# EasyEDA Pro project 显示30000版电池内阻仪.eprj, schematic Schematic1
Create Date: 2023-03-01; Page Name: P1; Project Name: 显示30000版电池内阻仪; Schematic Name: Schematic1; Update Date: 2023-04-18; Company: 嘉立创EDA; Page Size: A4; Version: V1.0
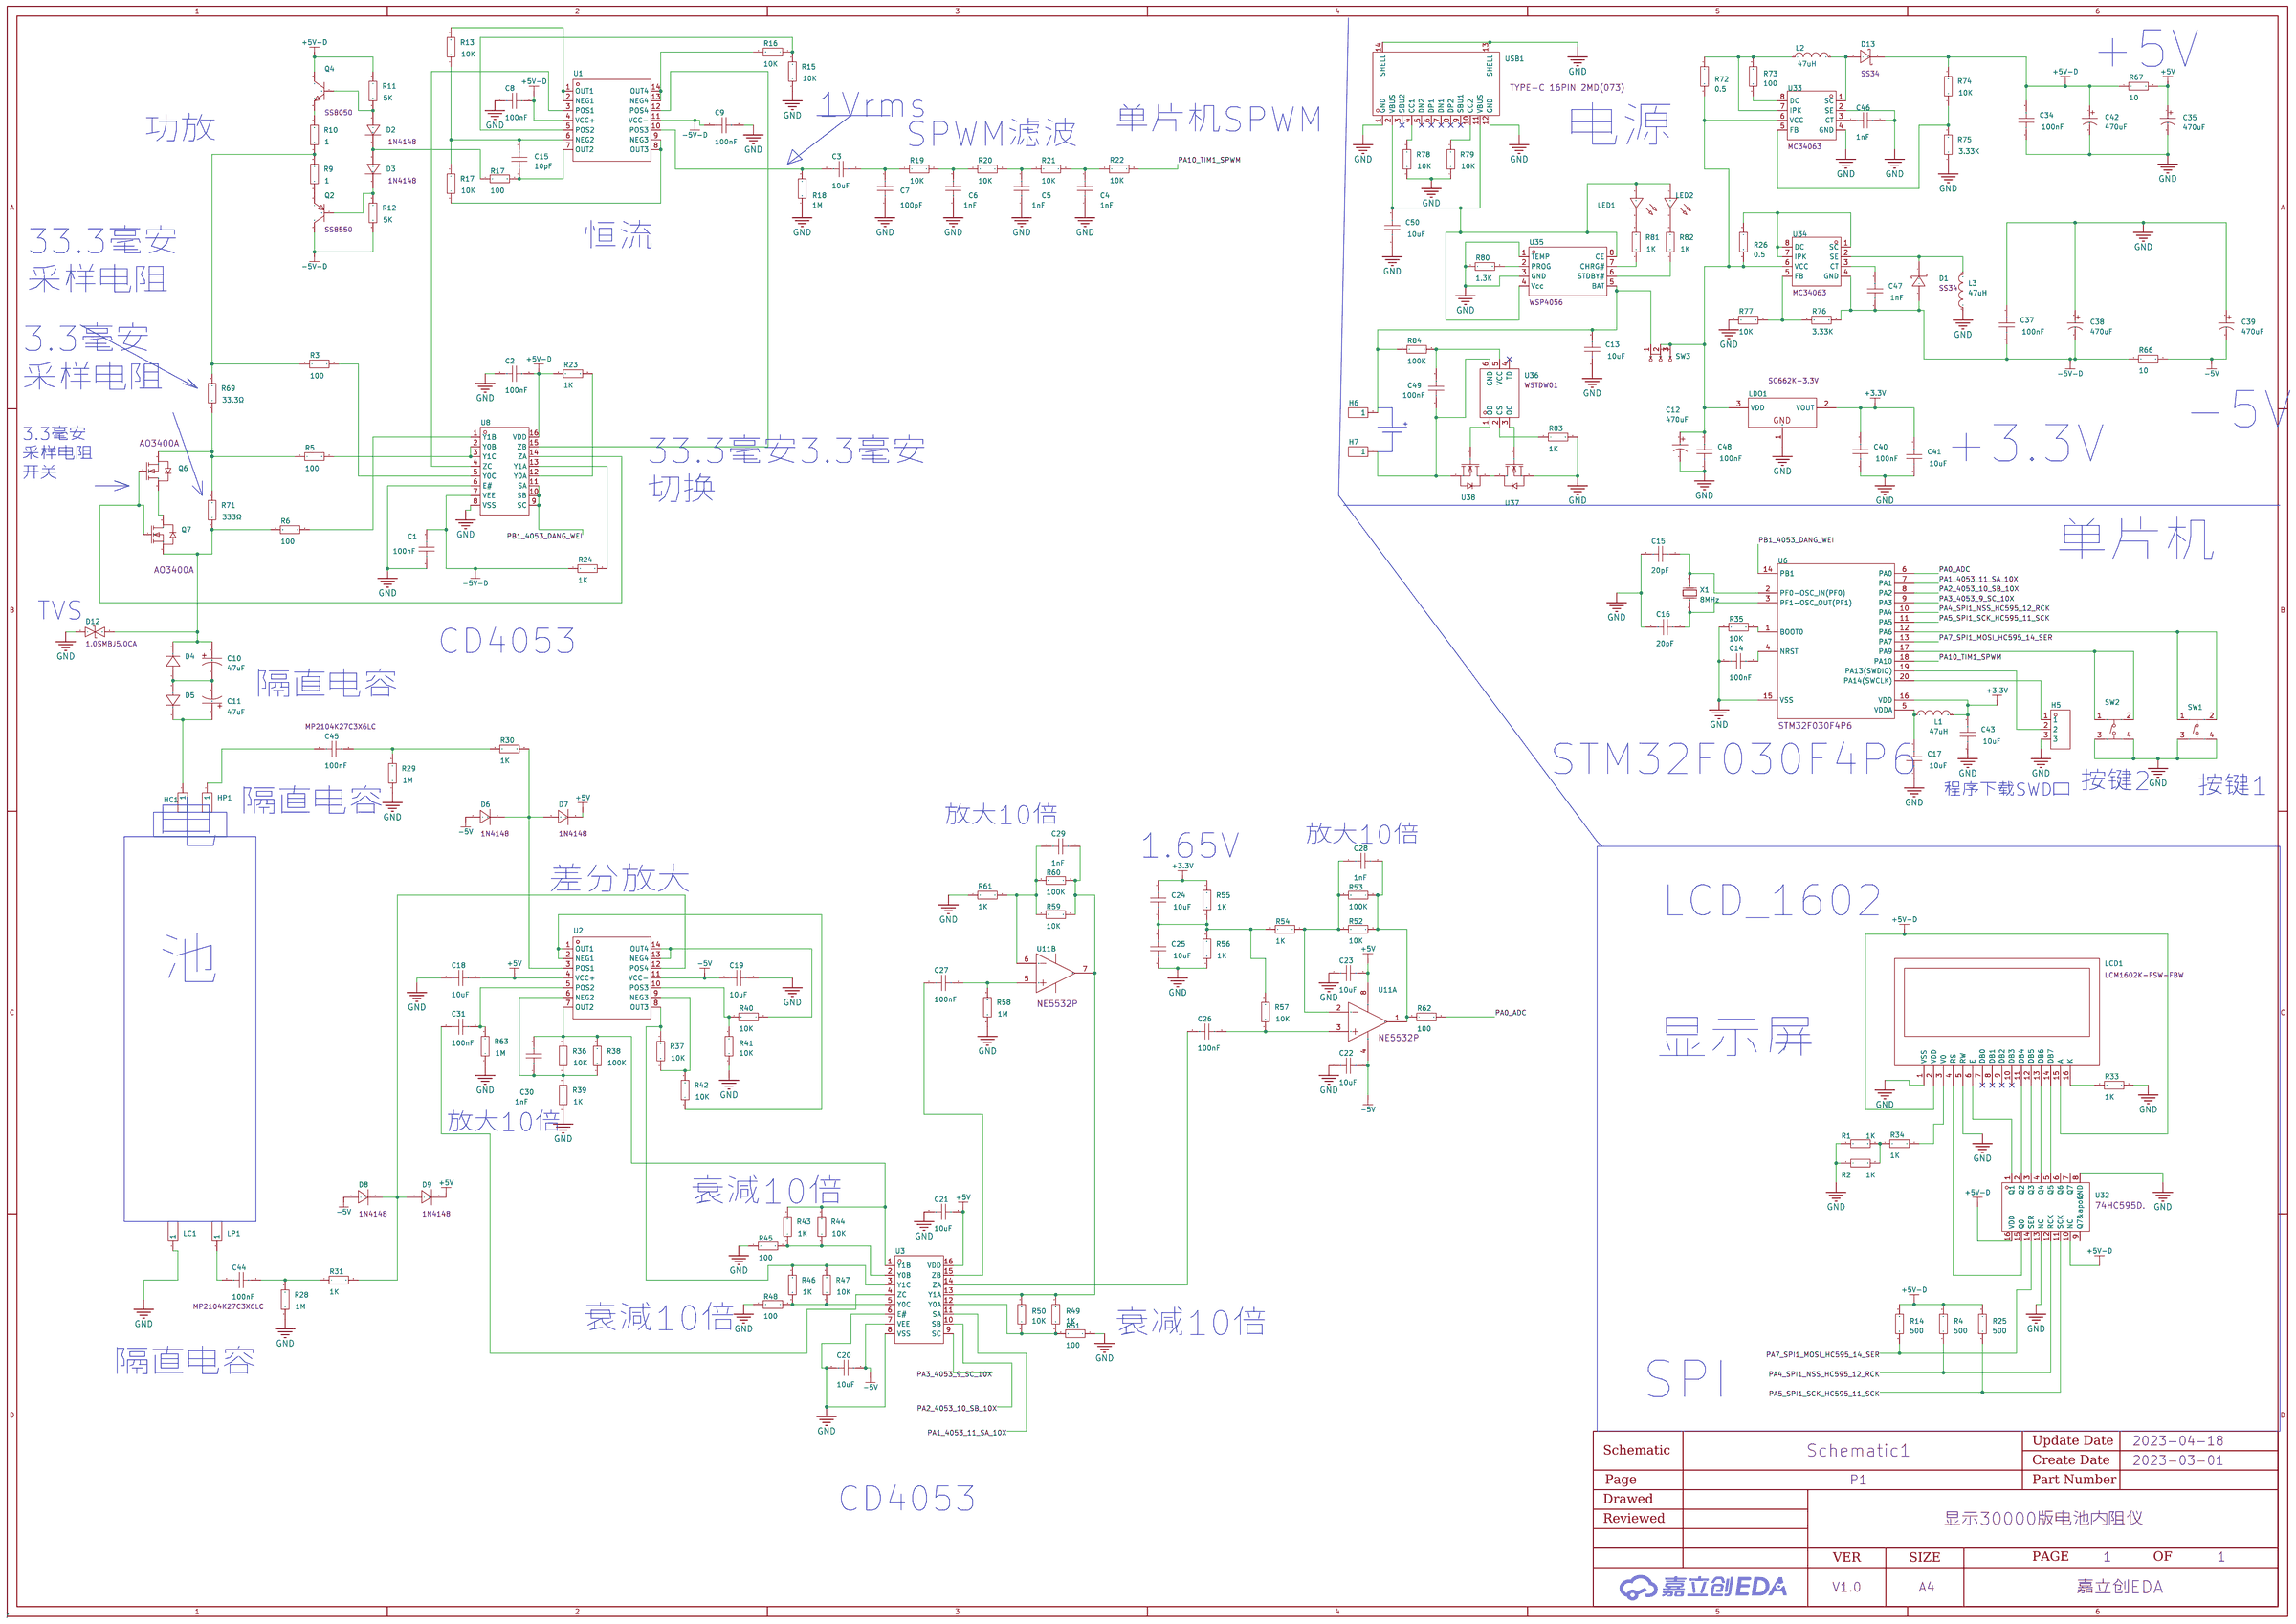
[diagram p0: schematic sheet]

## Parts
C1  100nF  [C0603]
C2  100nF  [C0603]
C3  10uF  [C0603]
C4  1nF  [C0603]
C5  1nF  [C0603]
C6  1nF  [C0603]
C7  100pF  [C0603]
C8  100nF  [C0603]
C9  100nF  [C0603]
C10  47uF  [CAP-TH_BD10.0-P5.00-D1.0-FD]
C11  47uF  [CAP-TH_BD10.0-P5.00-D1.0-FD]
C12  470uF  [CAP-TH_BD8.0-P3.50-D0.6-FD]
C13  10uF  [C0603]
C14  100nF  [C0603]
C15  20pF  [C0603]
C15#2  10pF  [C0603]
C16  20pF  [C0603]
C17  10uF  [C0603]
C18  10uF  [C0603]
C19  10uF  [C0603]
C20  10uF  [C0603]
C21  10uF  [C0603]
C22  10uF  [C0603]
C23  10uF  [C0603]
C24  10uF  [C0603]
C25  10uF  [C0603]
C26  100nF  [C0603]
C27  100nF  [C0603]
C28  1nF  [C0603]
C29  1nF  [C0603]
C30  1nF  [C0603]
C31  100nF  [C0603]
C34  100nF  [C0603]
C35  470uF  [CAP-TH_BD8.0-P3.50-D0.6-FD]
C37  100nF  [C0603]
C38  470uF  [CAP-TH_BD8.0-P3.50-D0.6-FD]
C39  470uF  [CAP-TH_BD8.0-P3.50-D0.6-FD]
C40  100nF  [C0603]
C41  10uF  [C0603]
C42  470uF  [CAP-TH_BD8.0-P3.50-D0.6-FD]
C43  10uF  [C0603]
C44  100nF  [CAP-TH_L13.0-W6.0-P10.00-D1.0]
C45  100nF  [CAP-TH_L13.0-W6.0-P10.00-D1.0]
C46  1nF  [C0603]
C47  1nF  [C0603]
C48  100nF  [C0603]
C49  100nF  [C0603]
C50  10uF  [C0603]
D1  SS34  [SMA_L4.3-W2.6-LS5.2-RD]
D2  1N4148  [DO-35_BD2.0-L4.0-P8.00-D0.5-FD]
D3  1N4148  [DO-35_BD2.0-L4.0-P8.00-D0.5-FD]
D4  -  [DO_1N4007]
D5  -  [DO_1N4007]
D6  1N4148  [DO-35_BD2.0-L4.0-P8.00-D0.5-FD]
D7  1N4148  [DO-35_BD2.0-L4.0-P8.00-D0.5-FD]
D8  1N4148  [DO-35_BD2.0-L4.0-P8.00-D0.5-FD]
D9  1N4148  [DO-35_BD2.0-L4.0-P8.00-D0.5-FD]
D12  1.0SMBJ5.0CA  [SMB_L4.6-W3.6-LS5.3-BI]
D13  SS34  [SMA_L4.3-W2.6-LS5.2-RD]
H5  -  [HDR-TH_3P-P2.54-V-M]
H6  -  [HDR-TH_1P-V-M_XKB_X4611WV-01I-C28D40]
H7  -  [HDR-TH_1P-V-M_XKB_X4611WV-01I-C28D40]
HC1  -  [HDR-TH_1P-V-M_XKB_X4611WV-01I-C28D40]
HP1  -  [HDR-TH_1P-V-M_XKB_X4611WV-01I-C28D40]
L1  47uH  [IND-SMD_L4.5-W4.0_SLF0403]
L2  47uH  [IND-SMD_L4.5-W4.0_SLF0403]
L3  47uH  [IND-SMD_L4.5-W4.0_SLF0403]
LC1  -  [HDR-TH_1P-V-M_XKB_X4611WV-01I-C28D40]
LCD1  LCM1602K-FSW-FBW  [MODULE-TH_LCM1602K]
LDO1  SC662K-3.3V  [SOT-23-3_L2.9-W1.3-P1.90-LS2.4-BR]
LED1  -  [LED_TH-3mm]
LED2  -  [LED_TH-3mm]
LP1  -  [HDR-TH_1P-V-M_XKB_X4611WV-01I-C28D40]
Q2  SS8550  [SOT-23-3_L2.9-W1.6-P1.90-LS2.8-BR]
Q4  SS8050  [SOT-23-3_L2.9-W1.6-P1.90-LS2.8-BR]
Q6  AO3400A  [SOT-23-3_L2.9-W1.3-P1.90-LS2.4-BR]
Q7  AO3400A  [SOT-23-3_L2.9-W1.3-P1.90-LS2.4-BR]
R1  1K  [R0603]
R2  1K  [R0603]
R3  100  [R0603]
R4  500  [R0603]
R5  100  [R0603]
R6  100  [R0603]
R9  1  [R0603]
R10  1  [R0603]
R11  5K  [R0603]
R12  5K  [R0603]
R13  10K  [R0603]
R14  500  [R0603]
R15  10K  [R0603]
R16  10K  [R0603]
R17  10K  [R0603]
R17#2  100  [R0603]
R18  1M  [R0603]
R19  10K  [R0603]
R20  10K  [R0603]
R21  10K  [R0603]
R22  10K  [R0603]
R23  1K  [R0603]
R24  1K  [R0603]
R25  500  [R0603]
R26  0.5  [R0603]
R28  1M  [R0603]
R29  1M  [R0603]
R30  1K  [R0603]
R31  1K  [R0603]
R33  1K  [R0603]
R34  1K  [R0603]
R35  10K  [R0603]
R36  10K  [R0603]
R37  10K  [R0603]
R38  100K  [R0603]
R39  1K  [R0603]
R40  10K  [R0603]
R41  10K  [R0603]
R42  10K  [R0603]
R43  1K  [R0603]
R44  10K  [R0603]
R45  100  [R0603]
R46  1K  [R0603]
R47  10K  [R0603]
R48  100  [R0603]
R49  1K  [R0603]
R50  10K  [R0603]
R51  100  [R0603]
R52  10K  [R0603]
R53  100K  [R0603]
R54  1K  [R0603]
R55  1K  [R0603]
R56  1K  [R0603]
R57  10K  [R0603]
R58  1M  [R0603]
R59  10K  [R0603]
R60  100K  [R0603]
R61  1K  [R0603]
R62  100  [R0603]
R63  1M  [R0603]
R66  10  [R0603]
R67  10  [R0603]
R69  33.3Ω  [R2512]
R71  333Ω  [R0603]
R72  0.5  [R0603]
R73  100  [R0603]
R74  10K  [R0603]
R75  3.33K  [R0603]
R76  3.33K  [R0603]
R77  10K  [R0603]
R78  10K  [R0603]
R79  10K  [R0603]
R80  1.3K  [R0603]
R81  1K  [R0603]
R82  1K  [R0603]
R83  1K  [R0603]
R84  100K  [R0603]
SW1  1TS005A-2600-5001  [SW-TH_4P-L6.0-W6.0-P4.50-LS6.5]
SW2  1TS005A-2600-5001  [SW-TH_4P-L6.0-W6.0-P4.50-LS6.5]
SW3  SS-12F20-G070  [SW-TH_G-SWITCH_SS-12F20-G070]
U1  TL084CN  [DIP-14_L17.8-W10.2-P2.54-BL]
U2  TL084CN  [DIP-14_L17.8-W10.2-P2.54-BL]
U3  CD4053BM/TR  [SOP-16_L9.9-W3.9-P1.27-LS6.1-BL]
U6  STM32F030F4P6  [TSSOP-20_L6.5-W4.4-P0.65-LS6.4-BL]
U8  CD4053BM/TR  [SOP-16_L9.9-W3.9-P1.27-LS6.1-BL]
U11  NE5532P  [DIP-8_L9.4-W6.4-P2.54-LS9.1-BL]  (sections 1,2)
U32  74HC595D.  [SOP-16_L9.9-W3.9-P1.27-LS6.0-BL]
U33  MC34063  [SOIC-8_L5.0-W4.0-P1.27-LS6.0-BL]
U34  MC34063  [SOIC-8_L5.0-W4.0-P1.27-LS6.0-BL]
U35  WSP4056  [SOP-8_L5.1-W3.9-P1.27-LS6.0-BL]
U36  WSTDW01  [SOT-23-6_L2.9-W1.6-P0.95-LS2.8-BR]
U37  AO3400A  [SOT-23-3_L3.0-W1.6-P1.90-LS2.8-BR]
U38  AO3400A  [SOT-23-3_L3.0-W1.6-P1.90-LS2.8-BR]
USB1  TYPE-C 16PIN 2MD(073)  [USB-C-SMD_TYPE-C-6PIN-2MD-073]
X1  8MHz  [OSC-TH_L10.0-W4.5-P5.00]

## Library data of the parts
C1-C9 C13-C15 C15#2 C16-C31 C34 C37 C40 C41 C43 C46-C50 = CAP_0603: Supplier Footprint: 0603
C10 C11 = KF470M200G200A: 容值:47uF;精度:±20%;额定电压:200V;电容体直径:10mm;电容体长度:20mm;脚间距:5mm;工作寿命:5000hrs@105℃;; LCSC Part Name: 47uF ±20% 200V; Supplier Part: C369596; Manufacturer: CapXon(丰宾); Supplier Footprint: 插件,D10xL20mm; JLCPCB Part Class: Extended Part; Datasheet: https://atta.szlcsc.com/upload/public/pdf/source/20190129/C369596_E235973F81FBE5AC0279A0A18FAB6034.pdf; Supplier: LCSC; Tolerance: ±20%; Rated Voltage: 200V; φD: 10mm; L: 20mm; Lead Spacing: 5mm; Lifetime @ Temp: 5000hrs@105℃
C12 C35 C38 C39 C42 = KM477M016F12RR0VH2FP0: 容值:470uF;精度:±20%;额定电压:16V;电容体直径:8mm;电容体长度:12mm;脚间距:3.5mm;工作寿命:2000hrs@105℃;; LCSC Part Name: 470uF ±20% 16V; Supplier Part: C28067; Manufacturer: CX(承兴); Supplier Footprint: 插件,D8xL12mm; JLCPCB Part Class: Extended Part; Datasheet: https://atta.szlcsc.com/upload/public/pdf/source/20211027/06D6BA3719C264B639DC286D935D03EA.pdf; Supplier: LCSC; Tolerance: ±20%; Rated Voltage: 16V; φD: 8mm; L: 12mm; Lead Spacing: 3.5mm; Lifetime @ Temp: 2000hrs@105℃
C44 C45 = MP2104K27C3X6LC: 等级:X2;容值:100nF;精度:±10%;; LCSC Part Name: 等级:X2 100nF ±10%; Supplier Part: C105759; Manufacturer: SRD(圣融达); Supplier Footprint: 径向引线,P=10mm; JLCPCB Part Class: Extended Part; Datasheet: https://atta.szlcsc.com/upload/public/pdf/source/20211112/28AD7BCA5F9A6D19E46F5213448E69C0.pdf; Supplier: LCSC; Subclass: X2; Tolerance: ±10%
D1 D13 = SS34_C8678: 二极管配置:独立式;直流反向耐压(Vr):40V;平均整流电流(Io):3A;正向压降(Vf):550mV@3A;反向电流(Ir):500uA@40V;; LCSC Part Name: 40V 3A 550mV@3A; Supplier Part: C8678; Manufacturer: MDD; Supplier Footprint: SMA(DO-214AC); JLCPCB Part Class: Basic Part; Datasheet: https://atta.szlcsc.com/upload/public/pdf/source/20230314/A80AE34493C69B89E2F4B1712F433538.pdf; Supplier: LCSC; Diode Configuration: 独立式; Reverse Voltage (Vr): 40V; Average Rectified Current (Io): 3A; Forward Voltage (Vf@If): 550mV@3A; Reverse Leakage Current (Ir): 500uA@40V
D2 D3 D6-D9 = 1N4148_C14516: 二极管配置:-;功率:500mW;直流反向耐压(Vr):75V;平均整流电流(Io):200mA;正向压降(Vf):1V@10mA;反向电流(Ir):5uA@75V;反向恢复时间(trr):4ns;工作温度:+200℃@(Tj);; LCSC Part Name: 75V 200mA 4ns; Supplier Part: C14516; Manufacturer: ST(先科); Supplier Footprint: DO-35; JLCPCB Part Class: Extended Part; Datasheet: https://atta.szlcsc.com/upload/public/pdf/source/20140303/1457707004955.pdf; Supplier: LCSC; Power Dissipation: 500mW; Reverse Voltage (Vr): 75V; Average Rectified Current (Io): 200mA; Forward Voltage (Vf@If): 1V@10mA; Reverse Leakage Current: 5uA@75V; Reverse Recovery Time (trr): 4ns; Operating Temperature: +200℃@(Tj)
D4 D5 = D_1N4007A: Supplier Footprint: DO-41
D12 = 1.0SMBJ5.0CA: 极性:双向;反向截止电压(Vrwm):5V;击穿电压:6.4V;峰值脉冲电流(Ipp)@10/1000s:108.7A;最大钳位电压:9.2V;; LCSC Part Name: 双向 Vrwm:5V; Supplier Part: C383719; Manufacturer: BORN(伯恩半导体); Supplier Footprint: SMB(DO-214AA); JLCPCB Part Class: Extended Part; Datasheet: https://atta.szlcsc.com/upload/public/pdf/source/20190401/C383719_42F4B236C492E082CA170168E9BED5C9.pdf; Supplier: LCSC; Polarity: 双向; Reverse Stand-Off Voltage (Vrwm): 5V; Breakdown Voltage: 6.4V; Peak Pulse Current (Ipp)@10/1000μs: 108.7A; Maximum Clamping Voltage: 9.2V
H5 = HDR-M_2.54_1x3P: Supplier Part: C2937625; Supplier Footprint: 插件
H6 H7 HC1 HP1 LC1 LP1 = HDR-M_2.54_1x1P: Supplier Part: C81276; Supplier Footprint: 插件; JLCPCB Part Class: Extended Part
L1-L3 = SLF0403-470KTT: 电感值:47uH;直流电阻(DCR):844mΩ;精度:±10%;额定电流:540mA;; LCSC Part Name: 47uH ±10%; Supplier Part: C182152; Manufacturer: Sunltech(韩国顺磁); Supplier Footprint: SMD; JLCPCB Part Class: Extended Part; Datasheet: https://atta.szlcsc.com/upload/public/pdf/source/20180622/C182152_7E479EAE8C34B9E34441182146F93730.pdf; Supplier: LCSC; Length: 4.5mm; Height: 3.2mm; Width: 4mm; DC Resistance (DCR): 844mΩ; Tolerance: ±10%; Rated Current: 540mA
LCD1 = LCM1602K-FSW-FBW: 尺寸(inch):-;主控芯片:KS0066U;; Supplier Part: C83274; Manufacturer: LONTECH(厦门龙特); JLCPCB Part Class: Extended Part; Datasheet: https://atta.szlcsc.com/upload/public/pdf/source/20161111/1478835373818.pdf; Supplier: LCSC; Main Control Chip: KS0066U
LDO1 = SC662K-3.3V: 输出类型:固定;输出极性:正;最大输入电压:6V;输出电压:3.3V;输出电流:250mA;电源纹波抑制比(PSRR):50dB@(1kHz);; LCSC Part Name: 正 Vin=6V Vout=3.3V 250mA 50dB@(1kHz); Supplier Part: C83932; Manufacturer: FM(富满); Supplier Footprint: SOT-23; JLCPCB Part Class: Extended Part; Datasheet: https://atta.szlcsc.com/upload/public/pdf/source/20161024/1477288576049.pdf; Supplier: LCSC; Output Type: 固定; Output Polarity: 正; Number of Outputs: 1; Maximum Input Voltage: 6V; Output Voltage: 3.3V; Dropout Voltage: 38mV@(10mA); Output Current: 250mA; Power Supply Rejection Ratio (PSRR): 50dB@(1kHz)
LED1 LED2 = LED_TH-R_3mm: Supplier Footprint: 插件
Q2 = SS8550_C5249677: Supplier Part: C5249677; Manufacturer: ElecSuper(静芯微）; Supplier Footprint: SOT-23; Datasheet: https://atta.szlcsc.com/upload/public/pdf/source/20221109/B5F89F270175419A606360AB14C12800.pdf; Supplier: LCSC
Q4 = SS8050_C5249676: Supplier Part: C5249676; Manufacturer: ElecSuper(静芯微）; Supplier Footprint: SOT-23; Datasheet: https://atta.szlcsc.com/upload/public/pdf/source/20221109/25143ABAE3EF3AA2633DA047E92DED74.pdf; Supplier: LCSC
Q6 Q7 = AO3400A_C347475: 类型:N沟道;漏源电压(Vdss):30V;连续漏极电流(Id):5.8A;功率(Pd):1.4W;导通电阻(RDS(on)@Vgs,Id):35mΩ@10V,5.8A;阈值电压(Vgs(th)@Id):1.4V@250uA;栅极电荷(Qg@Vgs):-;输入电容(Ciss@Vds):-;反向传输电容(Crss@Vds):-;; LCSC Part Name: N沟道 30V 5.8A; Supplier Part: C347475; Manufacturer: UMW(广东友台半导体); Supplier Footprint: SOT-23; JLCPCB Part Class: Extended Part; Datasheet: https://atta.szlcsc.com/upload/public/pdf/source/20220429/98B7D6B2B83615ED4523A0C76368EB06.pdf; Supplier: LCSC; Type: N沟道; Drain Source Voltage (Vdss): 30V; Continuous Drain Current (Id): 5.8A; Power Dissipation (Pd): 1.4W; Drain Source On Resistance (RDS(on)@Vgs,Id): 35mΩ@10V,5.8A; Gate Threshold Voltage (Vgs(th)@Id): 1.4V@250uA
R1-R6 R9-R17 R17#2 R18-R26 R28-R31 R33-R63 R66 R67 R72-R84 = Res_0603: Supplier Footprint: 0603
R69 = RC2512JK-7W10RL: 电阻类型:厚膜电阻;阻值:10Ω;精度:±5%;功率:2W;温度系数:±200ppm/℃;最大工作电压:200V;工作温度范围:-55℃~+155℃;; LCSC Part Name: 10Ω ±5% 2W; Supplier Part: C173291; Manufacturer: YAGEO(国巨); Supplier Footprint: 2512; JLCPCB Part Class: Extended Part; Datasheet: https://atta.szlcsc.com/upload/public/pdf/source/20180118/C173291_15162577119381279715.pdf; Supplier: LCSC; Type: 厚膜电阻; Tolerance: ±5%; Power(Watts): 2W; Temperature Coefficient: ±200ppm/℃; Overload Voltage (Max): 200V; Operating Temperature Range: -55℃~+155℃
R71 = AC0603FR-07100RL: 电阻类型:厚膜电阻;阻值:100Ω;精度:±1%;功率:100mW;温度系数:±100ppm/℃;最大工作电压:75V;工作温度范围:-55℃~+155℃;; LCSC Part Name: 100Ω ±1% 100mW; Supplier Part: C125923; Manufacturer: YAGEO(国巨); Supplier Footprint: 0603; JLCPCB Part Class: Extended Part; Datasheet: https://atta.szlcsc.com/upload/public/pdf/source/20171113/C125923_15105610630191115405.pdf; Supplier: LCSC; Type: 厚膜电阻; Tolerance: ±1%; Power(Watts): 100mW; Temperature Coefficient: ±100ppm/℃; Overload Voltage (Max): 75V; Operating Temperature Range: -55℃~+155℃
SW1 SW2 = 1TS005A-2600-5001: 触点电流:50mA;额定电压(DC):12V;额定功率:0.6W;绝缘电阻:100MΩ;电路结构:单刀单掷;安装方式:直插;按钮形状:圆形按钮;按钮/盖帽颜色:黑色;带灯:无;作用力:260gf@±50gf;机械寿命:70000;工作温度:-40℃~+90℃;引脚样式:PC引脚;开关长度:6mm;开关宽度:6mm;开关高度:5mm;带支架:否;; LCSC Part Name: 665.0插脚轻触开关  磷铜弹片 塑胶按钮; Supplier Part: C319407; Manufacturer: HYP(鸿源精密); Supplier Footprint: 插件,6x6mm; JLCPCB Part Class: Extended Part; Datasheet: https://atta.szlcsc.com/upload/public/pdf/source/20181106/C319407_4E51FE24A55B58584174907EB50BCBB8.pdf; Supplier: LCSC; Contact Current: 50mA; Voltage Rating (DC): 12V; Power Rating: 0.6W; Insulation Resistance: 100MΩ; Circuit: 单刀单掷; Mounting Style: 直插; Actuator Style: 圆形按钮; Actuator/Cap Color: 黑色; With Lamp: 无; Operating Force: 260gf@±50gf; Mechanical Life: 70000; Operating Temperature: -40℃~+90℃; Pin Style: PC引脚; Switch Length: 6mm; Switch Width: 6mm; Switch Height: 5mm; Strike Gundam: 否
SW3 = SS-12F20-G070: 额定电流(DC):500mA;额定电压(DC):250V;电路结构:单刀双掷;安装方式:直插;开关颜色:黑色;滑钮形状:矩形柱状;引脚样式:PC引脚;开关长度:11.5mm;开关宽度:5.8mm;开关高度:12mm;; LCSC Part Name: 直柄拨动开关SS-12F20 柄长7; Supplier Part: C2848914; Manufacturer: G-Switch(品赞); Supplier Footprint: 插件; JLCPCB Part Class: Extended Part; Datasheet: https://atta.szlcsc.com/upload/public/pdf/source/20210825/E0137178672C137814869A76188F885C.pdf; Supplier: LCSC; Current Rating (DC): 500mA; Voltage Rating (DC): 250V; Circuit: 单刀双掷; Mounting Style: 直插; Actuator Color: 黑色; Actuator Style: 矩形柱状; Pin Style: PC引脚; Switch Length: 11.5mm; Switch Width: 5.8mm; Switch Height: 12mm
U1 U2 = TL084CN: 运放类型:J-FET;放大器组数:4;增益带宽积（GBP）:4MHz;压摆率（SR）:16 V/us;电源电压:6V ~ 36V, ±3V ~ 18V;各通道供电电流:1.4mA;; Supplier Part: C54501; Manufacturer: TI(德州仪器); Supplier Footprint: DIP-14; JLCPCB Part Class: Extended Part; Datasheet: https://atta.szlcsc.com/upload/public/pdf/source/20150720/1457707333819.pdf; Supplier: LCSC; Amplifier Type: J-FET; Number of Circuits: 4; Gain Bandwidth Product（GBP）: 4MHz; Slew Rate（SR）: 16 V/us; Supply Voltage（Single）: 6V ~ 36V, ±3V ~ 18V; Iq per channel (Typ): 1.4mA; Operating Temperature: 0°C ~ 70°C
U3 U8 = CD4053BM/TR: LCSC Part Name: 具有逻辑电平转换功能的 CMOS 三路 2 通道模拟多路复用器和多路信号分离器; Supplier Part: C507160; Manufacturer: HGSEMI(华冠); Supplier Footprint: SOP-16; JLCPCB Part Class: Extended Part; Supplier: LCSC
U6 = STM32F030F4P6: CPU内核:ARM Cortex-M0;CPU最大主频:48MHz;工作电压范围:-;程序存储容量:16KB;RAM总容量:4KB;EEPROM/数据 FLASH容量:16KB;GPIO端口数量:-;ADC(位数):-;DAC(位数):-;(E)PWM(位数):-;内部振荡器:-;; LCSC Part Name: ARM Cortex-M0 48MHz; Supplier Part: C32908; Manufacturer: ST(意法半导体); Supplier Footprint: TSSOP-20; JLCPCB Part Class: Extended Part; Datasheet: https://atta.szlcsc.com/upload/public/pdf/source/20140704/1457707098580.pdf; Supplier: LCSC; CPU Core: ARM Cortex-M0; CPU Maximum Speed: 48MHz; Program Storage Size: 16KB; Program Memory Type: FLASH; RAM Size: 4KB; EEPROM: 16KB
U11 = NE5532P: 运放类型:General Purpose;放大器组数:2;增益带宽积（GBP）:10MHz;压摆率（SR）:9 V/us;电源电压:±5V ~ 15V;各通道供电电流:8mA;; Supplier Part: C5326; Manufacturer: TI(德州仪器); Supplier Footprint: DIP-8; JLCPCB Part Class: Extended Part; Datasheet: https://atta.szlcsc.com/upload/public/pdf/source/20120402/1457706462184.pdf; Supplier: LCSC; Amplifier Type: General Purpose; Number of Circuits: 2; Gain Bandwidth Product（GBP）: 10MHz; Slew Rate（SR）: 9 V/us; Supply Voltage（Single）: ±5V ~ 15V; Iq per channel (Typ): 8mA; Operating Temperature: 0°C ~ 70°C
U32 = 74HC595D.: Supplier Part: C2929943; Manufacturer: FM(富满); Supplier Footprint: SOP-16; JLCPCB Part Class: Extended Part; Datasheet: https://atta.szlcsc.com/upload/public/pdf/source/20211125/20F1E3849D7C8A7DB346B0C433D530E9.pdf; Supplier: LCSC
U33 U34 = MC34063_C5349988: 功能类型:升降压型;同步整流:-;输出类型:可调;输出通道数:1;拓扑结构:-;输入电压:3V~40V;输出电压:1.25V~40V;输出电流(最大值):1.3A;开关频率:100kHz;静态电流(Iq):-;工作温度:0℃~+70℃@(TA);; LCSC Part Name: 升降压型 Vin=3V~40V Vout=1.25V~40V 1.3A; Supplier Part: C5349988; Manufacturer: HXY MOSFET(华轩阳电子); Supplier Footprint: SOP-8; JLCPCB Part Class: Extended Part; Datasheet: https://atta.szlcsc.com/upload/public/pdf/source/20230111/7114FCC45CA56B1B2A6F1749BAEC45FA.pdf; Supplier: LCSC; Function: 升降压型; Output Type: 可调; Number of Outputs: 1; Minimum Input Voltage: 3V; Maximum Input Voltage: 40V; Input Voltage: 3V~40V; Output Voltage: 1.25V~40V; Output Current (Max): 1.3A; Switching Frequency: 100kHz; Operating Temperature: 0℃~+70℃@(TA)
U35 = WSP4056: Supplier Part: C2985892; Manufacturer: WINSOK(微硕); Supplier Footprint: SOP-8; JLCPCB Part Class: Extended Part; Supplier: LCSC
U36 = WSTDW01: 充电电池的类型:-;电池单元组数:-;最大充电电流:-;充满的电池组电压:-;最大供应电压:-;; Supplier Part: C86873; Manufacturer: WINSOK(微硕); Supplier Footprint: SOT-23-6; JLCPCB Part Class: Extended Part; Datasheet: https://atta.szlcsc.com/upload/public/pdf/source/20161110/1478743415995.pdf; Supplier: LCSC
U37 U38 = AO3400A_C5224194: 类型:N沟道;漏源电压(Vdss):30V;连续漏极电流(Id):6A;功率(Pd):1.4W;导通电阻(RDS(on)@Vgs,Id):19mΩ@10V,6.0A;阈值电压(Vgs(th)@Id):1V@250uA;; LCSC Part Name: N沟道 30V 6A; Supplier Part: C5224194; Manufacturer: ElecSuper(静芯微）; Supplier Footprint: SOT-23-3L; Datasheet: https://atta.szlcsc.com/upload/public/pdf/source/20221027/D95D9171DDBB7BB324532F3AF1EADB7E.pdf; Supplier: LCSC; Type: N沟道; Drain Source Voltage (Vdss): 30V; Continuous Drain Current (Id): 6A; Power Dissipation (Pd): 1.4W; Drain Source On Resistance (RDS(on)@Vgs,Id): 19mΩ@10V,6.0A; Gate Threshold Voltage (Vgs(th)@Id): 1V@250uA
USB1 = TYPE-C 16PIN 2MD(073): 连接器类型:Type-C;标准:-;公母:母座;触点数量:16;端口数量:1;安装方式:卧贴;额定电流 - 电源:5A;工作温度范围:-25℃~+85℃;; LCSC Part Name: TYPE-C母座 16P 4脚插件带定位柱 不锈钢外壳 2次模顶; Supplier Part: C2765186; Manufacturer: SHOU HAN(首韩); Supplier Footprint: SMD; JLCPCB Part Class: Extended Part; Datasheet: https://atta.szlcsc.com/upload/public/pdf/source/20211123/39B17C16241EAC15C5E277BDA434118E.pdf; Supplier: LCSC; Connector Type: Type-C; Gender: 母座; Number of Contacts: 16; Number of Ports: 1; Mounting Style: 卧贴; Current Rating - Power (Max): 5A; Operating Temperature Range: -25℃~+85℃
X1 = X49SD8MSD2SC: 晶振类型:49S晶振;频率:8MHz;频率公差:±20ppm;频率稳定度:±30ppm;负载电容:20pF;工作温度:-20℃~+70℃;; LCSC Part Name: HC-49US 8MHz ±20ppm 20pF; Supplier Part: C21263; Manufacturer: YXC(扬兴晶振); Supplier Footprint: HC-49S; JLCPCB Part Class: Extended Part; Datasheet: https://atta.szlcsc.com/upload/public/pdf/source/20210903/A997D130AE99CBB55D9024F9BE6DA174.pdf; Supplier: LCSC; Crystal Type: 49S晶振; Frequency Tolerance: ±20ppm; Frequency Stability: ±30ppm; Load Capacitance: 20pF; Operating Temperature: -20℃~+70℃

## Nets
+3.3V: C24.2 C40.2 C41.2 C43.2 L1.2 LDO1.2(VOUT) R55.2 U6.16(VDD)
+5V: C18.2 C21.2 C23.2 C35.1 D7.2(C) D9.2(C) R67.2 U2.4(VCC+) U3.16(VDD) U11.8(VCC+)
+5V-D: C2.2 C8.2 C34.2 C42.1 D13.1(K) LCD1.2(VDD) LCD1.15(A) Q4.3(C) R4.2 R11.2 R14.2 R23.1 R25.2 R67.1 R74.2 U1.4(VCC+) U8.16(VDD) U32.10(NC) U32.16(VDD)
-5V: C19.1 C20.2 C22.2 C39.2 D6.1(A) D8.1(A) R66.2 U2.11(VCC-) U3.7(VEE) U11.4(VCC-)
-5V-D: C1.2 C9.1 C37.1 C38.2 C47.1 D1.2(A) Q2.3(C) R12.1 R24.1 R66.1 R76.2 U1.11(VCC-) U8.7(VEE) U34.4(GND)
GND: C1.1 C2.1 C4.1 C5.1 C6.1 C7.1 C8.1 C9.2 C12.2 C13.1 C14.2 C15.2 C16.2 C17.1 C18.1 C19.2 C20.1 C21.1 C22.1 C23.1 C25.1 C34.1 C35.2 C37.2 C38.1 C39.1 C40.1 C41.1 C42.2 C43.1 C46.2 C48.1 C50.1 D12.1 H5.3 L3.1 LC1.1 LCD1.1(VSS) LCD1.5(RW) LDO1.1(GND) R1.1 R2.1 R15.1 R18.1 R28.1 R29.1 R33.2 R35.2 R39.1 R41.1 R45.1 R48.1 R51.1 R56.1 R58.1 R61.1 R63.1 R75.1 R77.1 R78.1 R79.1 R80.1 R83.2 SW1.3 SW1.4 SW2.3 SW2.4 U3.6(E#) U3.8(VSS) U6.15(VSS) U8.6(E#) U8.8(VSS) U32.8(GND) U32.13(NC) U33.2(SE) U33.4(GND) U35.1(TEMP) U35.3(GND) U37.2(S) USB1.1(GND) USB1.12(GND) USB1.13(SHELL) USB1.14(SHELL)
PA0_ADC: R62.2 U6.6(PA0)
PA1_4053_11_SA_10X: U3.11(SA) U6.7(PA1)
PA2_4053_10_SB_10X: U3.10(SB) U6.8(PA2)
PA3_4053_9_SC_10X: U3.9(SC) U6.9(PA3)
PA4_SPI1_NSS_HC595_12_RCK: R4.1 U6.10(PA4) U32.12(RCK)
PA5_SPI1_SCK_HC595_11_SCK: R25.1 U6.11(PA5) U32.11(SCK)
PA7_SPI1_MOSI_HC595_14_SER: R14.1 U6.13(PA7) U32.14(SER)
PA10_TIM1_SPWM: R22.2 U6.18(PA10)
PB1_4053_DANG_WEI: U6.14(PB1) U8.9(SC) U8.10(SB) U8.11(SA)
$1N2503: Q6.2(S) R5.1 R69.1 R71.2
$1N4522: C10.1 D4.1(K) D12.2 Q7.2(S) R6.1 R71.1
$1N4539: R6.2 U8.1(Y1B)
$1N5596: Q2.2(E) R9.1
$1N5676: Q4.2(E) R10.2
$1N6884: R15.2 R16.1 U1.5(POS2)
$1N6914: R16.2 U1.13(NEG4) U1.14(OUT4)
$1N7022: R13.2 U1.1(OUT1) U1.2(NEG1)
$1N7251: C3.1 R18.2 U1.10(POS3)
$1N8310: C3.2 C7.2 R19.1
$1N8402: C6.2 R19.2 R20.1
$1N8494: C5.2 R20.2 R21.1
$1N8586: C4.2 R21.2 R22.1
$1N12567: Q6.3(D) Q7.3(D)
$1N13727: R24.2 U8.13(Y1A)
$1N14310: Q6.1(G) Q7.1(G) U8.14(ZA)
$1N14625: U1.12(POS4) U8.15(ZB)
$1N14690: U1.3(POS1) U8.4(ZC)
$1N15443: R5.2 U8.2(Y0B) U8.3(Y1C)
$1N15545: R3.2 U8.5(Y0C)
$1N15824: R23.2 U8.12(Y0A)
$1N18428: C10.2 C11.2 D4.2(A) D5.2(A)
$1N21004: C45.1 R29.2 R30.1
$1N21176: C44.1 R28.2 R31.1
$1N32014: LCD1.16(K) R33.1
$1N33242: LCD1.11(DB4) U32.2(Q2)
$1N33289: LCD1.12(DB5) U32.3(Q3)
$1N33336: LCD1.13(DB6) U32.4(Q4)
$1N33383: LCD1.14(DB7) U32.5(Q5)
$1N33961: LCD1.6(E) U32.1(Q1)
$1N34010: LCD1.4(RS) U32.15(Q0)
$1N34377: LCD1.3(V0) R34.2
$1N38466: C14.1 U6.4(NRST)
$1N38585: R35.1 U6.1(BOOT0)
$1N39082: C15.1 U6.2(PF0-OSC_IN(PF0)) X1.1(OSC1)
$1N39137: C16.1 U6.3(PF1-OSC_OUT(PF1)) X1.2(OSC2)
$1N41107: C17.2 L1.1 U6.5(VDDA)
$1N43119: R42.1 U2.1(OUT1) U2.2(NEG1)
$1N43180: R40.2 U2.13(NEG4) U2.14(OUT4)
$1N44869: C30.2 R36.1 R38.2 R43.2 R44.2 U2.7(OUT2) U3.1(Y1B)
$1N45226: C30.1 R36.2 R38.1 R39.2 U2.6(NEG2)
$1N46458: R37.1 R42.2 U2.9(NEG3)
$1N46863: R40.1 R41.2 U2.10(POS3)
$1N47509: D6.2(C) D7.1(A) R30.2 U2.3(POS1)
$1N53554: R37.2 R46.2 R47.2 U2.8(OUT3) U3.3(Y1C)
$1N53555: R46.1 R47.1 R48.2 U3.5(Y0C)
$1N53825: C29.2 R49.2 R50.2 R59.2 R60.1 U3.13(Y1A) U11.7(OUT2)
$1N53826: R49.1 R50.1 R51.2 U3.12(Y0A)
$1N54675: R43.1 R44.1 R45.2 U3.2(Y0B)
$1N57431: C28.1 R52.1 R53.2 R54.1 U11.2(IN1-)
$1N60276: C28.2 R52.2 R53.1 R62.1 U11.1(OUT1)
$1N63379: C24.1 C25.2 R54.2 R55.1 R56.2 R57.2
$1N64752: C26.2 R57.1 U11.3(IN1+)
$1N65001: C27.2 R58.2 U11.5(IN2+)
$1N65468: C29.1 R59.1 R60.2 R61.2 U11.6(IN2-)
$1N66675: C26.1 U3.14(ZA)
$1N66770: C27.1 U3.15(ZB)
$1N80254: H5.2 U6.19(PA13(SWDIO))
$1N80871: SW2.1 SW2.2 U6.17(PA9)
$1N81993: SW1.1 SW1.2 U6.12(PA6)
$1N91644: C31.1 U3.4(ZC)
$1N91645: C31.2 R63.2 U2.5(POS2)
$1N174858: D8.2(C) D9.1(A) R31.2 U2.12(POS4)
$1N181368: R1.2 R2.2 R34.1
$1N184453: H5.1 U6.20(PA14(SWCLK))
$1N216247: D13.2(A) L2.2 U33.1(SC)
$1N219597: L2.1 R72.1 R73.2 U33.7(IPK)
$1N220800: R73.1 U33.8(DC)
$1N221940: C46.1 U33.3(CT)
$1N223416: R74.1 R75.2 U33.5(FB)
$1N224380: R26.1 U34.1(SC) U34.7(IPK) U34.8(DC)
$1N225642: D1.1(K) L3.2 U34.2(SE)
$1N226684: C47.2 U34.3(CT)
$1N230914: R76.1 R77.2 U34.5(FB)
$1N242916: C50.2 LED1.1(C) LED2.1(C) U35.4(Vcc) U35.8(CE) USB1.2(VBUS) USB1.11(VBUS)
$1N243941: R78.2 USB1.4(CC1)
$1N244092: R79.2 USB1.10(CC2)
$1N245387: R80.2 U35.2(PROG)
$1N247017: LED1.2(A) R81.2
$1N247239: LED2.2(A) R82.2
$1N247546: R81.1 U35.7(CHRG#)
$1N247702: R82.1 U35.6(STDBY#)
$1N255065: U37.3(D) U38.3(D)
$1N255538: U36.1(OD) U38.1(G)
$1N255699: U36.3(OC) U37.1(G)
$1N256086: R83.1 U36.2(CS)
$1N256828: C49.1 H7.1 U36.6(GND) U38.2(S)
$1N257154: C49.2 R84.2 U36.5(VCC)
$1N261246: C13.2 H6.1 R84.1 SW3.1 U35.5(BAT)
$1N261413: C12.1 C48.2 LDO1.3(VDD) R26.2 R72.2 SW3.2 SW3.3 U33.6(VCC) U34.6(VCC)
Net-(C11-1): C11.1 D5.1(K) HC1.1
Net-(C15#2-1): C15#2.1 R17#2.2 U1.7(OUT2)
Net-(C15#2-2): C15#2.2 R13.1 R17.2 U1.6(NEG2)
Net-(C44-2): C44.2 LP1.1
Net-(C45-2): C45.2 HP1.1
Net-(D2-1): D2.1(A) Q4.1(B) R11.1
Net-(D2-2): D2.2(C) D3.1(A) R17#2.1
Net-(D3-2): D3.2(C) Q2.1(B) R12.2
Net-(R3-1): R3.1 R9.2 R10.1 R69.2
Net-(R17-1): R17.1 U1.8(OUT3) U1.9(NEG3)

Not connected (* = marked no-connect by the designer): LCD1 7(DB0)* 8(DB1)* 9(DB2)* 10(DB3)*; U32 6(Q6) 7(Q7) 9(Q7&apos;); U36 4(TD)*; USB1 3(SBU2)* 5(DN2)* 6(DP1)* 7(DN1)* 8(DP2)* 9(SBU1)*

## Notes on the sheet
- +5V
- 1Vrms
- 单片机SPWM
- 功放
- SPWM滤波
- 电源
- 恒流
- 33.3毫安
  采样电阻
- 3.3毫安
  采样电阻
- +
- -5V
- +3.3V
- 3.3毫安
  采样电阻
  开关
- 33.3毫安3.3毫安
  切换
- 单片机
- TVS
- CD4053
- 隔直电容
- STM32F030F4P6
- 程序下载SWD口
- 按键2
- 按键1
- 隔直电容
- 放大10倍
- 放大10倍
- 1.65V
- 差分放大
- LCD_1602
- 电
  池
- 显示屏
- 放大10倍
- 衰減10倍
- 衰減10倍
- 衰减10倍
- 隔直电容
- SPI
- CD4053
